# EAGLE schematic 4channelsRelayv2 (EAGLE 6.1)
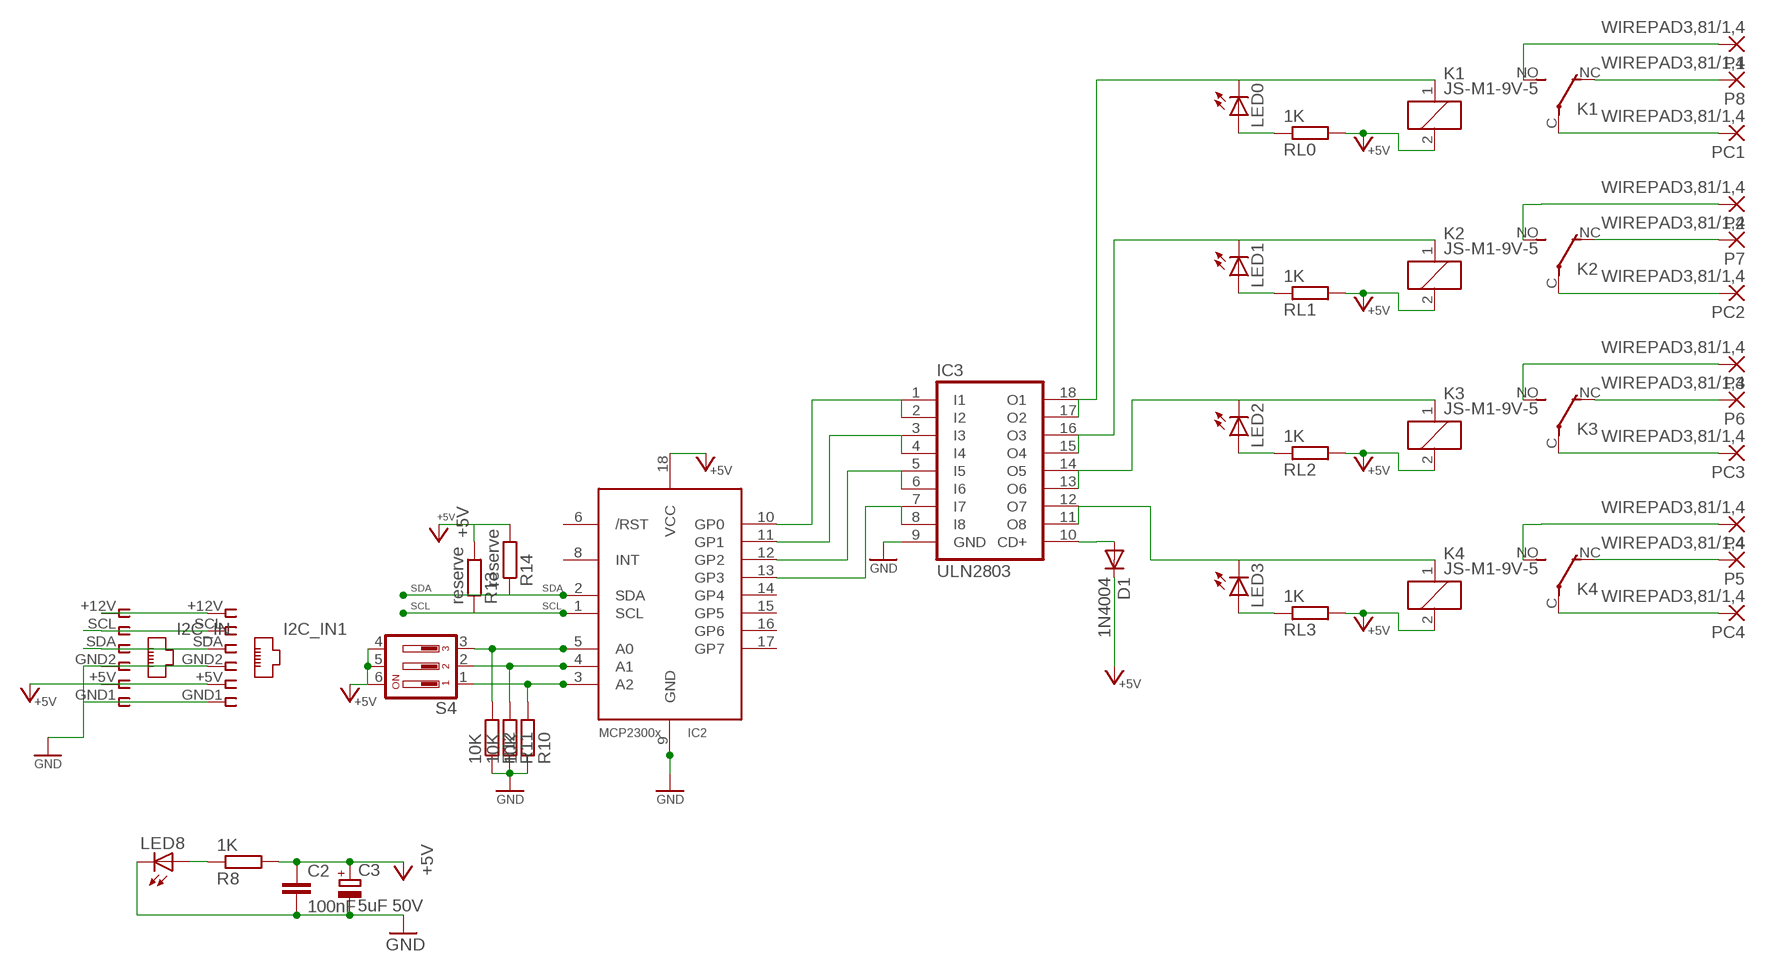
[diagram p0: schematic, sheet 1]

## Parts
C2  100nF  C-EUC1206  [C1206]
C3  5uF 50V  CPOL-EUE3.5-8  [E3,5-8]
D1  1N4004  [DO41-10]
I2C_IN  I2C 1  RJ12STRAIGHT-I2C  [RJ12-STRAIGHT-I2C]
I2C_IN1  I2C 2  RJ12STRAIGHT-I2C  [RJ12-STRAIGHT-I2C]
IC2  MCP2300X/P  [DIL18]
IC3  ULN2803  ULN2803A  [DIL18]
K1  JS-M1-9V-5  [JS-M]
K2  JS-M1-9V-5  [JS-M]
K3  JS-M1-9V-5  [JS-M]
K4  JS-M1-9V-5  [JS-M]
LED0  LED3MM  [LED3MM]
LED1  LED3MM  [LED3MM]
LED2  LED3MM  [LED3MM]
LED3  LED3MM  [LED3MM]
LED8  LED3MM  [LED3MM]
P1  WIREPAD3,81/1,4  [3,81/1,4]
P2  WIREPAD3,81/1,4  [3,81/1,4]
P3  WIREPAD3,81/1,4  [3,81/1,4]
P4  WIREPAD3,81/1,4  [3,81/1,4]
P5  WIREPAD3,81/1,4  [3,81/1,4]
P6  WIREPAD3,81/1,4  [3,81/1,4]
P7  WIREPAD3,81/1,4  [3,81/1,4]
P8  WIREPAD3,81/1,4  [3,81/1,4]
PC1  WIREPAD3,81/1,4  [3,81/1,4]
PC2  WIREPAD3,81/1,4  [3,81/1,4]
PC3  WIREPAD3,81/1,4  [3,81/1,4]
PC4  WIREPAD3,81/1,4  [3,81/1,4]
R8  1K  R-EU_M1206  [M1206]
R10  10K  R-EU_M1206  [M1206]
R11  10K  R-EU_M1206  [M1206]
R12  10K  R-EU_M1206  [M1206]
R13  reserve  R-EU_M1206  [M1206]
R14  reserve  R-EU_M1206  [M1206]
RL0  1K  R-EU_M1206  [M1206]
RL1  1K  R-EU_M1206  [M1206]
RL2  1K  R-EU_M1206  [M1206]
RL3  1K  R-EU_M1206  [M1206]
S4  DIP03YL  [DIP03YL]

## Nets
+5V [highpower]: C2.1 C3.+ D1.C I2C_IN1.+5V I2C_IN.+5V IC2.18(VCC) K1.2 K2.2 K3.2 K4.2 R8.2 R13.2 R14.2 RL0.2 RL1.2 RL2.2 RL3.2 S4.4 S4.5 S4.6
CD+: D1.A IC3.10(CD+)
GND [highpower]: C2.2 C3.- I2C_IN1.GND1 I2C_IN1.GND2 I2C_IN.GND1 I2C_IN.GND2 IC2.9(GND) IC3.9(GND) LED8.K(C) R10.1 R11.1 R12.1
N$1 [power]: IC3.15(O4) IC3.16(O3) K2.1 LED1.K(C)
N$2: LED0.A RL0.1
N$3 [power]: IC3.17(O2) IC3.18(O1) K1.1 LED0.K(C)
N$4: LED1.A RL1.1
N$5 [highpower]: I2C_IN1.+12V I2C_IN.+12V
N$6 [highpower]: K1.NC(2:O) P8.1(P)
N$7 [highpower]: K2.NC(2:O) P7.1(P)
N$8 [highpower]: K4.NO(2:S) P4.1(P)
N$9 [power]: IC3.11(O8) IC3.12(O7) K4.1 LED3.K(C)
N$10 [highpower]: K3.NC(2:O) P6.1(P)
N$11 [highpower]: K3.NO(2:S) P3.1(P)
N$12 [highpower]: K4.C(2:P) PC4.1(P)
N$13 [highpower]: K4.NC(2:O) P5.1(P)
N$14 [highpower]: K2.NO(2:S) P2.1(P)
N$15 [highpower]: K3.C(2:P) PC3.1(P)
N$16: IC2.5(A0) R12.2 S4.3
N$17: IC2.4(A1) R11.2 S4.2
N$18: IC2.3(A2) R10.2 S4.1
N$19 [highpower]: K1.NO(2:S) P1.1(P)
N$20 [highpower]: K2.C(2:P) PC2.1(P)
N$23: LED8.A R8.1
N$38: LED2.A RL2.1
N$40 [power]: IC3.13(O6) IC3.14(O5) K3.1 LED2.K(C)
N$41: LED3.A RL3.1
P0: IC2.10(GP0) IC3.1(I1) IC3.2(I2)
P1: IC2.11(GP1) IC3.3(I3) IC3.4(I4)
P2: IC2.12(GP2) IC3.5(I5) IC3.6(I6)
P3: IC2.13(GP3) IC3.7(I7) IC3.8(I8)
POWER1 [highpower]: K1.C(2:P) PC1.1(P)
SCL: I2C_IN1.SCL I2C_IN.SCL IC2.1(SCL) R13.1
SDA: I2C_IN1.SDA I2C_IN.SDA IC2.2(SDA) R14.1
Unconnected: IC2.6(/RST) IC2.8(INT) IC2.14(GP4) IC2.15(GP5) IC2.16(GP6) IC2.17(GP7)

## Library data of the parts
C2 = rcl:C-EU: CAPACITOR, European symbol
C3 = rcl:CPOL-EU: POLARIZED CAPACITOR, European symbol
D1 = diode:1N4004: DIODE general purpose rectifier, 1 A
I2C_IN I2C_IN1 = lpatiny:RJ12: CORCOM Modular RJ Jacks No Shield Source: www.tycoelectronics.com .. ENG_DS_1654001_1099_RJ_L_0507.pdf
IC2 = adafruit:MCP2300X: MCP23008 Inexpensive i2c i/o expander - 8 general purpose i/o pins with optional pullups
IC3 = uln-udn:ULN2803A: DRIVER ARRAY
K1-K4 = relay:JS-M1*: Automotive Ultra-Miniature Power Relay NAiS Source: http://www.mew-europe.com/.. en_ds_61211_0000.pdf; OC_FARNELL: unknown; OC_NEWARK: unknown
LED0 LED1-LED3 LED8 = lpatiny:LED3MM
P1-P8 PC1-PC4 = wirepad:WIREPAD: Wire PAD connect wire on PCB
R8 R10-R14 RL0 RL1-RL3 = resistor:R-EU_: RESISTOR, European symbol
S4 = switch-dil:DIP03YL: DIL/CODE SWITCH; OC_FARNELL: unknown; OC_NEWARK: unknown

## Net classes
0 default: width 0.457 mm
1 power: width 0.914 mm
2 highpower: width 1.372 mm